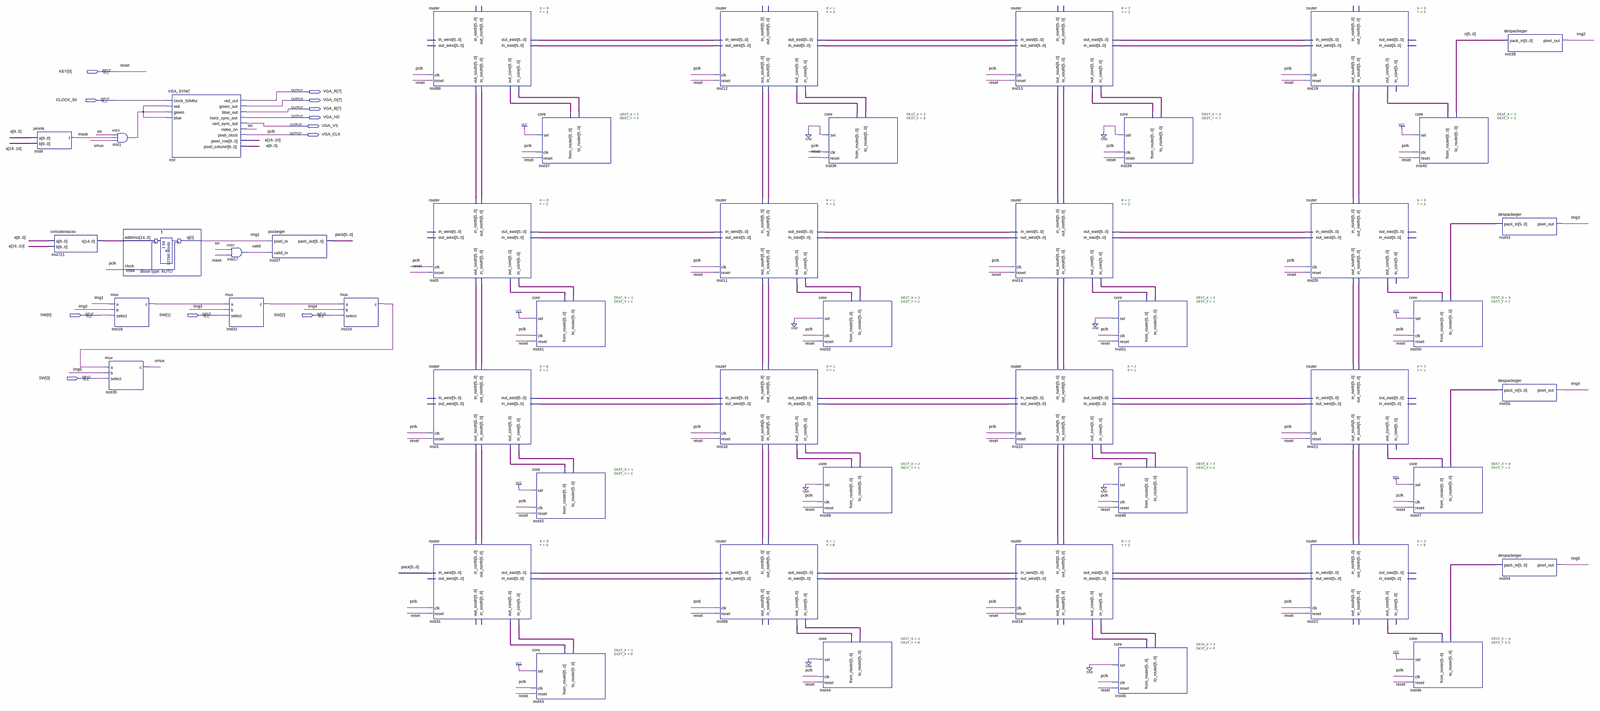
[diagram p0: schematic sheet, whole]
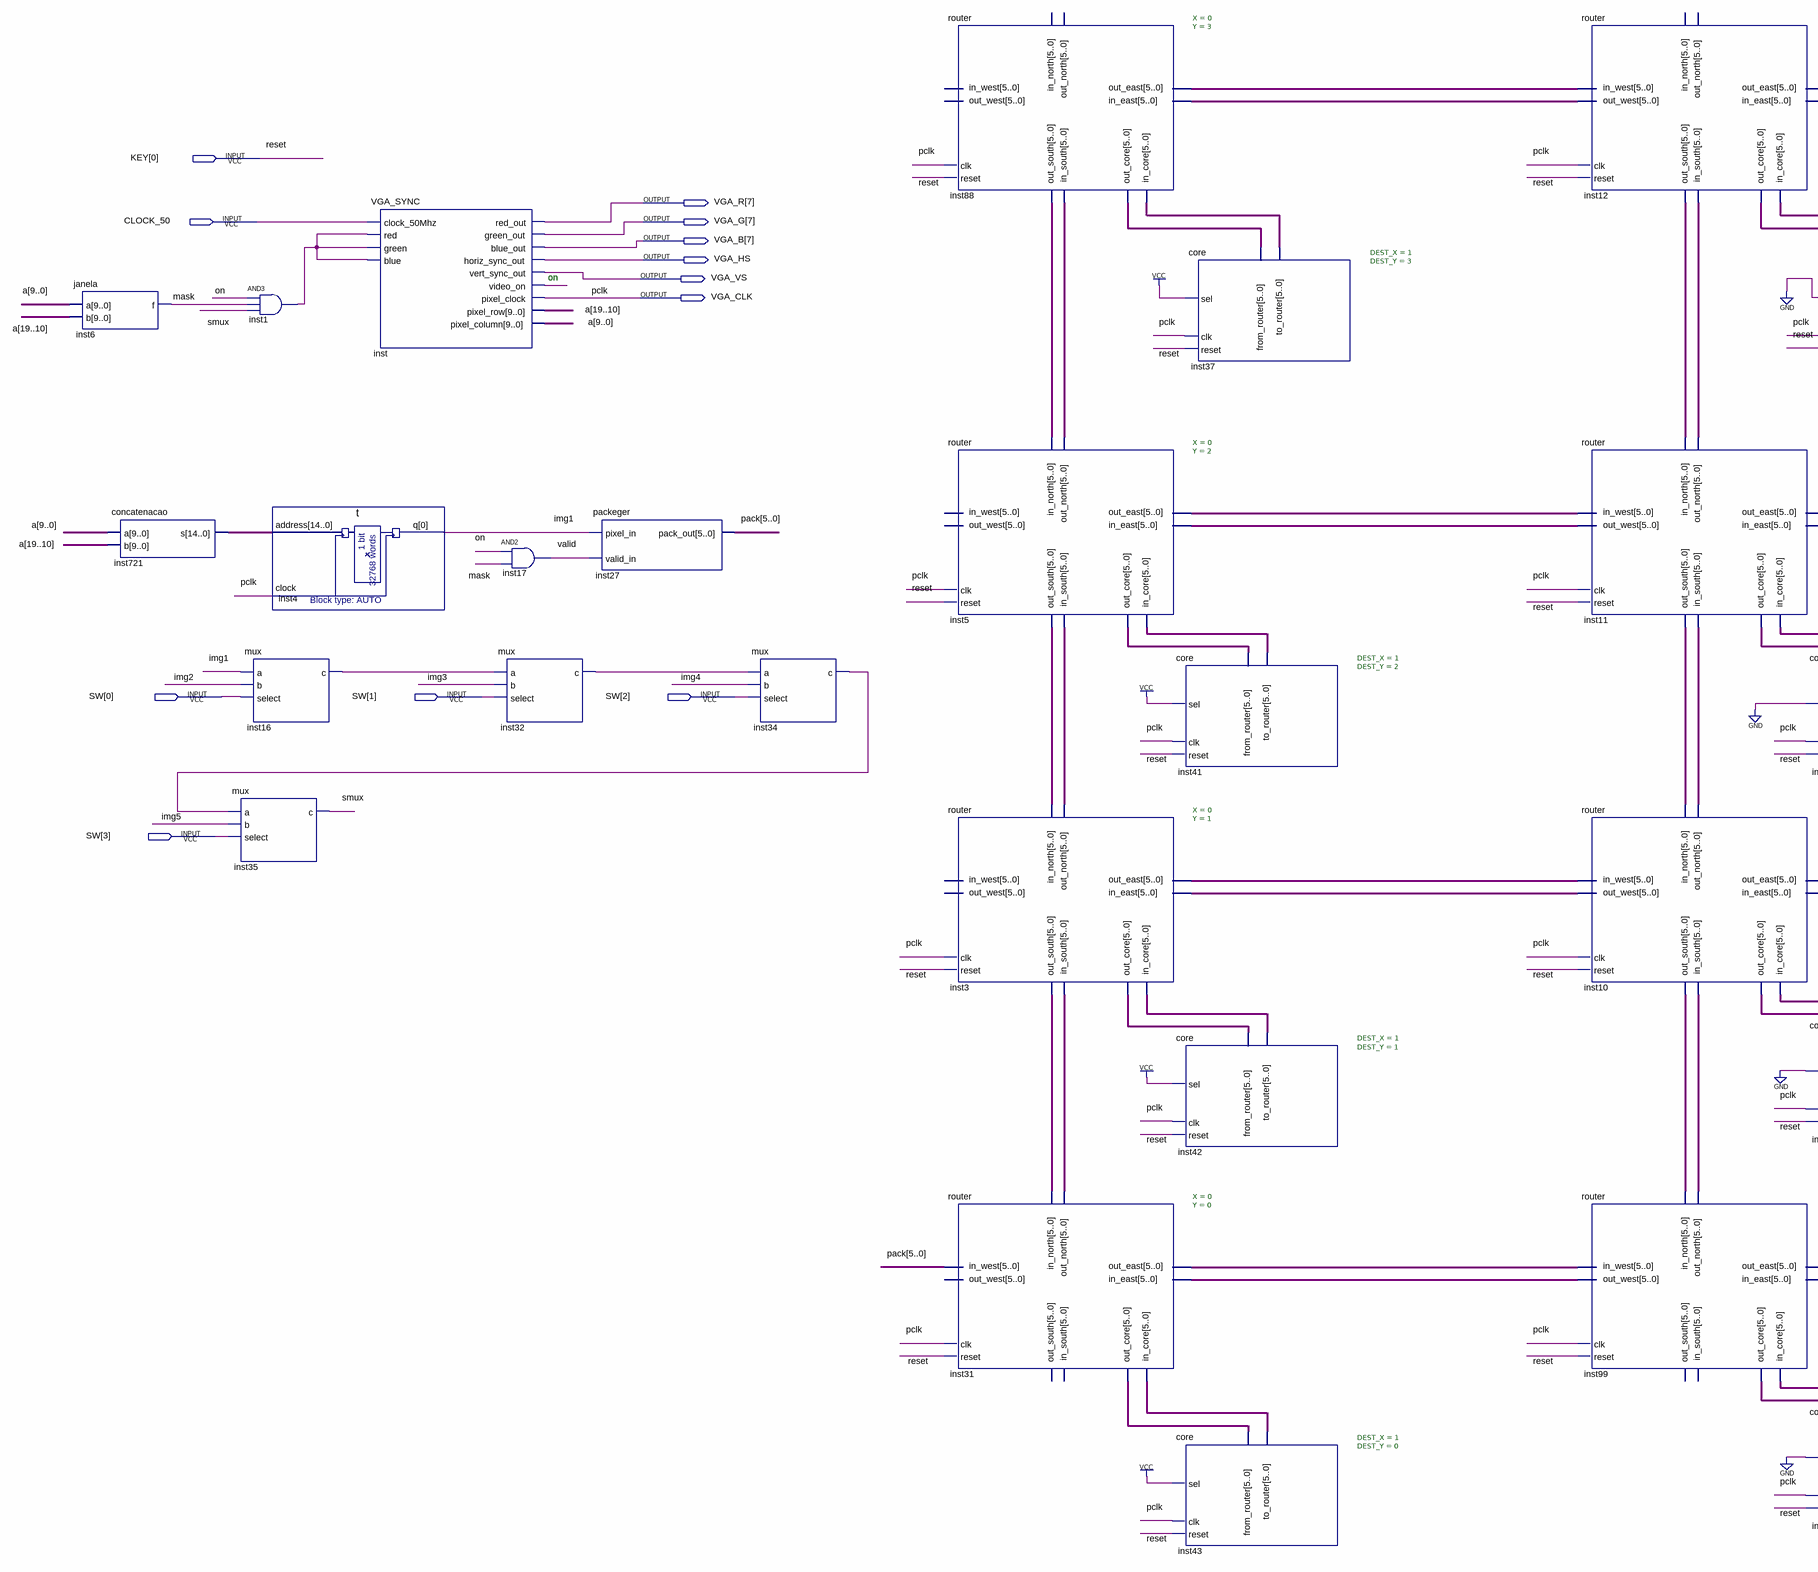
[diagram p1: schematic sheet, left part]
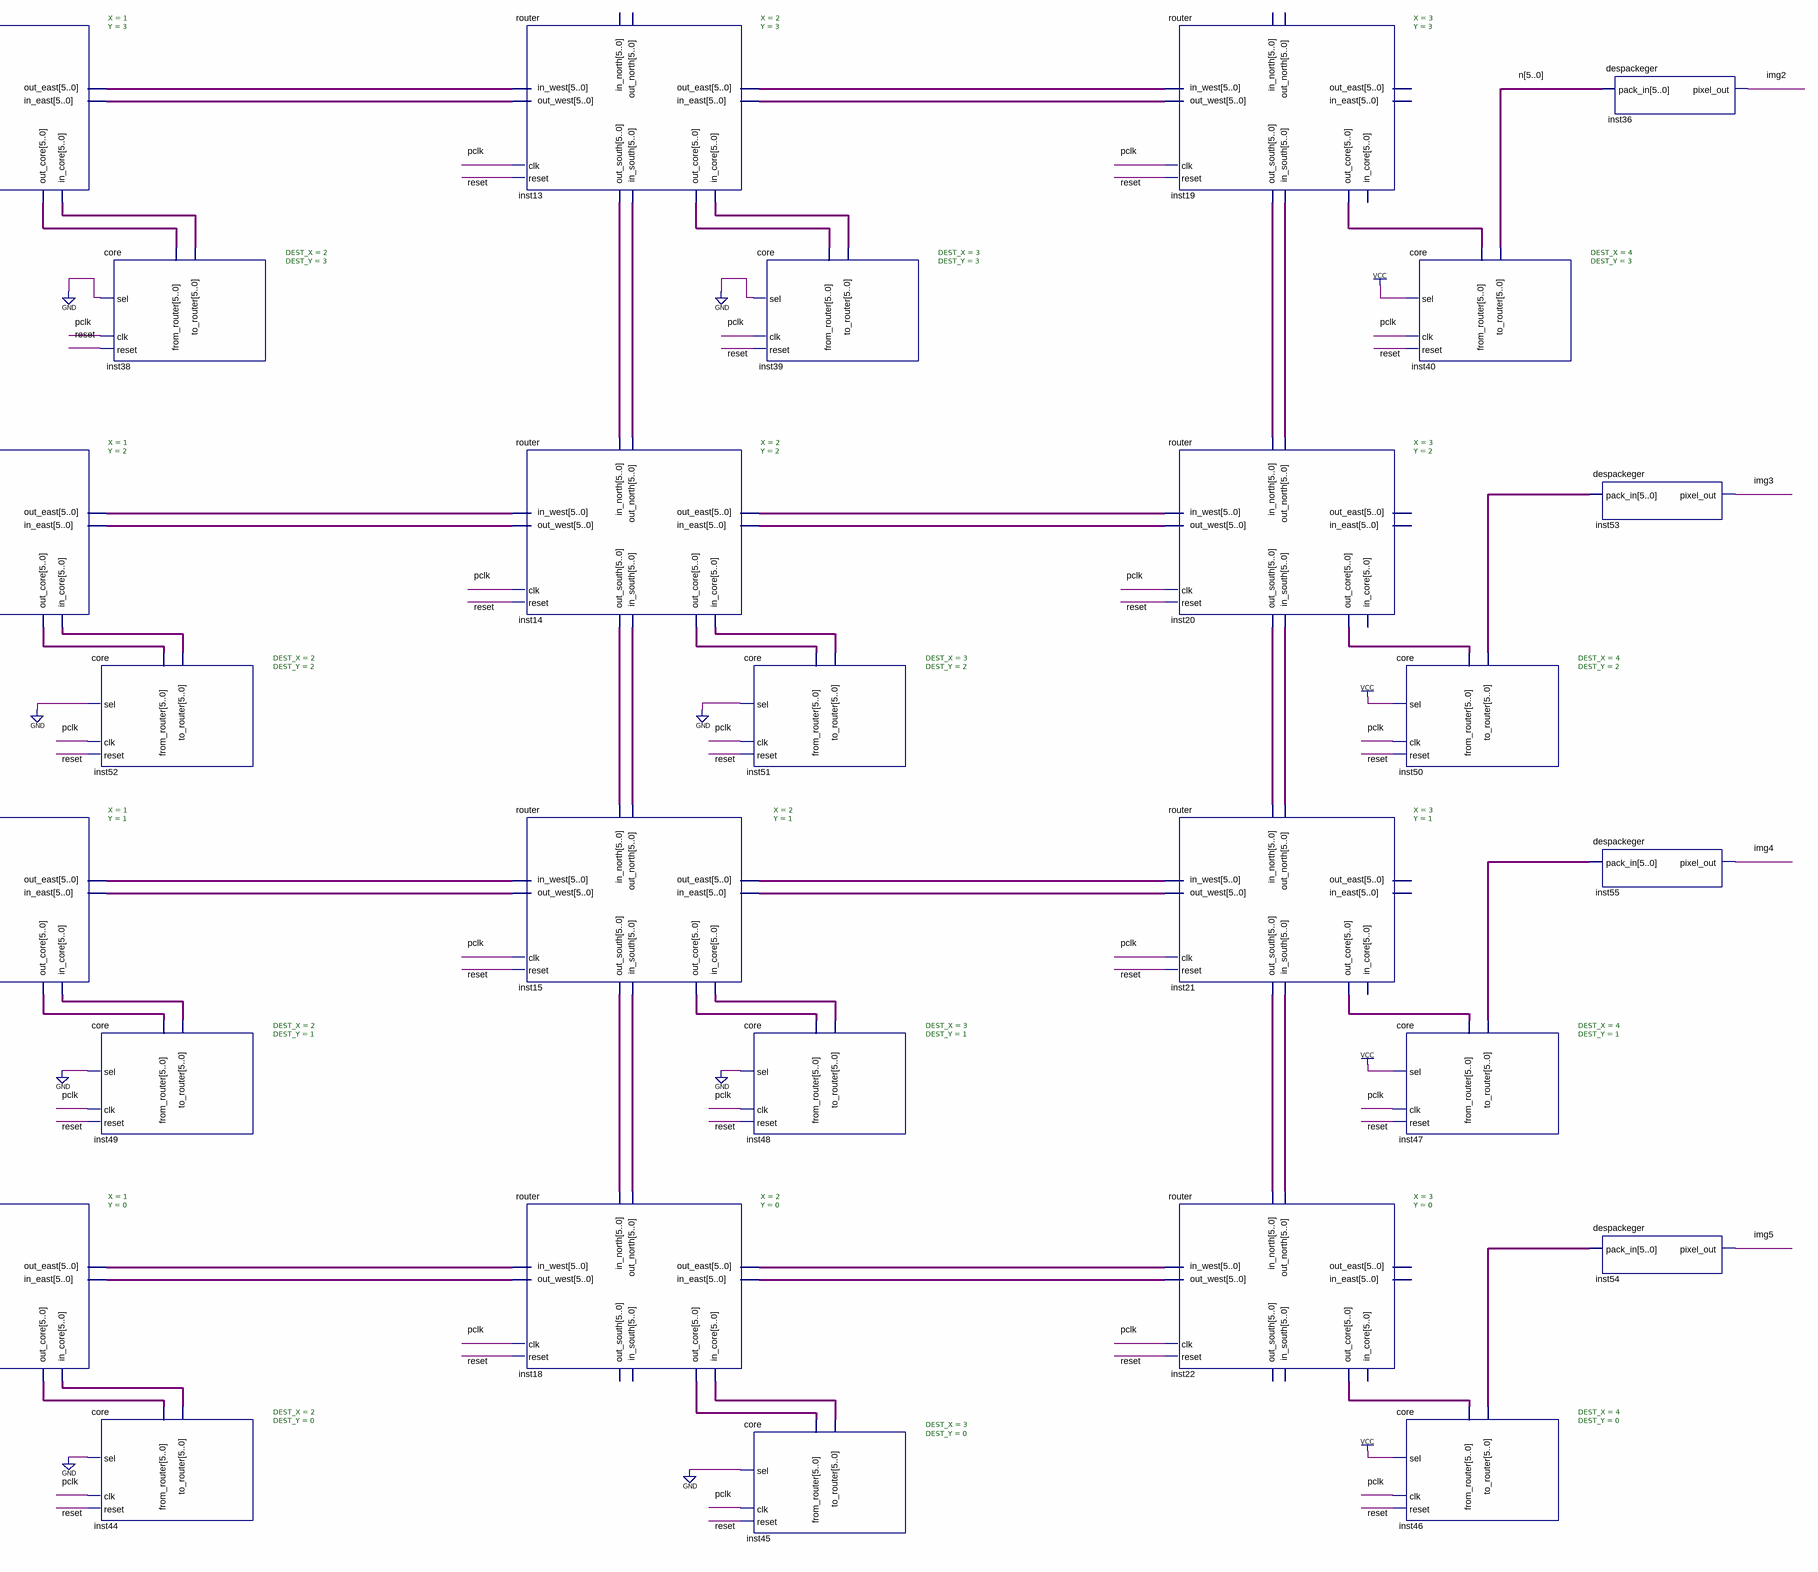
[diagram p2: schematic sheet, right part]
// Quartus schematic MeshPDI.bdf as structural Verilog: 47 symbols, 12 pins
module MeshPDI (
  input  [0:0] KEY,
  input  CLOCK_50,
  input  [3:0] SW,
  output [7:7] VGA_R,
  output [7:7] VGA_G,
  output [7:7] VGA_B,
  output VGA_HS,
  output VGA_VS,
  output VGA_CLK
);

  wire img1, img2, img3, img4, img5, inst1_out, inst16_c, inst32_c, inst34_c, mask, on, smux, valid;
  wire [5:0] inst3_out_core, inst3_out_east, inst3_out_north, inst3_out_south, inst5_out_core,
       inst5_out_east, inst5_out_north, inst5_out_south, inst10_out_core, inst10_out_east, inst10_out_north,
       inst10_out_south, inst10_out_west, inst11_out_core, inst11_out_east, inst11_out_north,
       inst11_out_south, inst11_out_west, inst12_out_core, inst12_out_east, inst12_out_south,
       inst12_out_west, inst13_out_core, inst13_out_east, inst13_out_south, inst13_out_west, inst14_out_core,
       inst14_out_east, inst14_out_north, inst14_out_south, inst14_out_west, inst15_out_core,
       inst15_out_east, inst15_out_north, inst15_out_south, inst15_out_west, inst18_out_core,
       inst18_out_east, inst18_out_north, inst18_out_west, inst19_out_core, inst19_out_south,
       inst19_out_west, inst20_out_core, inst20_out_north, inst20_out_south, inst20_out_west,
       inst21_out_core, inst21_out_north, inst21_out_south, inst21_out_west, inst22_out_core,
       inst22_out_north, inst22_out_west, inst31_out_core, inst31_out_east, inst31_out_north,
       inst37_to_router, inst38_to_router, inst39_to_router, inst41_to_router, inst42_to_router,
       inst43_to_router, inst44_to_router, inst45_to_router, inst46_to_router, inst47_to_router,
       inst48_to_router, inst49_to_router, inst50_to_router, inst51_to_router, inst52_to_router,
       inst88_out_core, inst88_out_east, inst88_out_south, inst99_out_core, inst99_out_east,
       inst99_out_north, inst99_out_west, n, pack;
  wire [14:0] inst721_s;
  wire [19:0] a;

  janela inst6 (.a(a[9:0]), .b(a[19:10]), .f(mask));
  concatenacao inst721 (.a(a[9:0]), .b(a[19:10]), .s(inst721_s));
  and inst1 (inst1_out, on, mask, smux);
  mux inst16 (.a(img1), .b(img2), .select(SW[0]), .c(inst16_c));
  mux inst35 (.a(inst34_c), .b(img5), .select(SW[3]), .c(smux));
  t inst4 (.address(inst721_s), .clock(VGA_CLK), .q(img1));
  VGA_SYNC inst (
    .clock_50Mhz(CLOCK_50), .red(inst1_out), .green(inst1_out), .blue(inst1_out), .red_out(VGA_R[7]),
    .green_out(VGA_G[7]), .blue_out(VGA_B[7]), .horiz_sync_out(VGA_HS), .vert_sync_out(VGA_VS),
    .video_on(on), .pixel_clock(VGA_CLK), .pixel_row(a[19:10]), .pixel_column(a[9:0]));
  and inst17 (valid, on, mask);
  mux inst32 (.a(inst16_c), .b(img3), .select(SW[1]), .c(inst32_c));
  packeger inst27 (.pixel_in(img1), .valid_in(valid), .pack_out(pack));
  mux inst34 (.a(inst32_c), .b(img4), .select(SW[2]), .c(inst34_c));
  router #(.X(0), .Y(3)) inst88 (
    .clk(VGA_CLK), .reset(KEY[0]), .in_east(inst12_out_west), .in_south(inst5_out_north),
    .in_core(inst37_to_router), .out_east(inst88_out_east), .out_south(inst88_out_south),
    .out_core(inst88_out_core));  // open: in_west, in_north, out_west, out_north
  router #(.X(0), .Y(2)) inst5 (
    .clk(VGA_CLK), .reset(KEY[0]), .in_east(inst11_out_west), .in_north(inst88_out_south),
    .in_south(inst3_out_north), .in_core(inst41_to_router), .out_east(inst5_out_east),
    .out_north(inst5_out_north), .out_south(inst5_out_south), .out_core(inst5_out_core));  // open: in_west, out_west
  router #(.X(0), .Y(1)) inst3 (
    .clk(VGA_CLK), .reset(KEY[0]), .in_east(inst10_out_west), .in_north(inst5_out_south),
    .in_south(inst31_out_north), .in_core(inst42_to_router), .out_east(inst3_out_east),
    .out_north(inst3_out_north), .out_south(inst3_out_south), .out_core(inst3_out_core));  // open: in_west, out_west
  router #(.X(0), .Y(0)) inst31 (
    .clk(VGA_CLK), .reset(KEY[0]), .in_west(pack), .in_east(inst99_out_west), .in_north(inst3_out_south),
    .in_core(inst43_to_router), .out_east(inst31_out_east), .out_north(inst31_out_north),
    .out_core(inst31_out_core));  // open: in_south, out_west, out_south
  core #(.DEST_X(1), .DEST_Y(3)) inst37 (
    .clk(VGA_CLK), .reset(KEY[0]), .sel(1'b1), .from_router(inst88_out_core), .to_router(inst37_to_router));
  core #(.DEST_X(1), .DEST_Y(2)) inst41 (
    .clk(VGA_CLK), .reset(KEY[0]), .sel(1'b1), .from_router(inst5_out_core), .to_router(inst41_to_router));
  core #(.DEST_X(1), .DEST_Y(1)) inst42 (
    .clk(VGA_CLK), .reset(KEY[0]), .sel(1'b1), .from_router(inst3_out_core), .to_router(inst42_to_router));
  core #(.DEST_X(1), .DEST_Y(0)) inst43 (
    .clk(VGA_CLK), .reset(KEY[0]), .sel(1'b1), .from_router(inst31_out_core), .to_router(inst43_to_router));
  router #(.X(1), .Y(3)) inst12 (
    .clk(VGA_CLK), .reset(KEY[0]), .in_west(inst88_out_east), .in_east(inst13_out_west),
    .in_south(inst11_out_north), .in_core(inst38_to_router), .out_west(inst12_out_west),
    .out_east(inst12_out_east), .out_south(inst12_out_south), .out_core(inst12_out_core));  // open: in_north, out_north
  router #(.X(1), .Y(2)) inst11 (
    .clk(VGA_CLK), .reset(KEY[0]), .in_west(inst5_out_east), .in_east(inst14_out_west),
    .in_north(inst12_out_south), .in_south(inst10_out_north), .in_core(inst52_to_router),
    .out_west(inst11_out_west), .out_east(inst11_out_east), .out_north(inst11_out_north),
    .out_south(inst11_out_south), .out_core(inst11_out_core));
  router #(.X(1), .Y(1)) inst10 (
    .clk(VGA_CLK), .reset(KEY[0]), .in_west(inst3_out_east), .in_east(inst15_out_west),
    .in_north(inst11_out_south), .in_south(inst99_out_north), .in_core(inst49_to_router),
    .out_west(inst10_out_west), .out_east(inst10_out_east), .out_north(inst10_out_north),
    .out_south(inst10_out_south), .out_core(inst10_out_core));
  router #(.X(1), .Y(0)) inst99 (
    .clk(VGA_CLK), .reset(KEY[0]), .in_west(inst31_out_east), .in_east(inst18_out_west),
    .in_north(inst10_out_south), .in_core(inst44_to_router), .out_west(inst99_out_west),
    .out_east(inst99_out_east), .out_north(inst99_out_north), .out_core(inst99_out_core));  // open: in_south, out_south
  core #(.DEST_X(2), .DEST_Y(3)) inst38 (
    .clk(VGA_CLK), .reset(KEY[0]), .sel(1'b0), .from_router(inst12_out_core), .to_router(inst38_to_router));
  core #(.DEST_X(2), .DEST_Y(2)) inst52 (
    .clk(VGA_CLK), .reset(KEY[0]), .sel(1'b0), .from_router(inst11_out_core), .to_router(inst52_to_router));
  core #(.DEST_X(2), .DEST_Y(1)) inst49 (
    .clk(VGA_CLK), .reset(KEY[0]), .sel(1'b0), .from_router(inst10_out_core), .to_router(inst49_to_router));
  core #(.DEST_X(2), .DEST_Y(0)) inst44 (
    .clk(VGA_CLK), .reset(KEY[0]), .sel(1'b0), .from_router(inst99_out_core), .to_router(inst44_to_router));
  router #(.X(2), .Y(3)) inst13 (
    .clk(VGA_CLK), .reset(KEY[0]), .in_west(inst12_out_east), .in_east(inst19_out_west),
    .in_south(inst14_out_north), .in_core(inst39_to_router), .out_west(inst13_out_west),
    .out_east(inst13_out_east), .out_south(inst13_out_south), .out_core(inst13_out_core));  // open: in_north, out_north
  router #(.X(2), .Y(2)) inst14 (
    .clk(VGA_CLK), .reset(KEY[0]), .in_west(inst11_out_east), .in_east(inst20_out_west),
    .in_north(inst13_out_south), .in_south(inst15_out_north), .in_core(inst51_to_router),
    .out_west(inst14_out_west), .out_east(inst14_out_east), .out_north(inst14_out_north),
    .out_south(inst14_out_south), .out_core(inst14_out_core));
  router #(.X(2), .Y(1)) inst15 (
    .clk(VGA_CLK), .reset(KEY[0]), .in_west(inst10_out_east), .in_east(inst21_out_west),
    .in_north(inst14_out_south), .in_south(inst18_out_north), .in_core(inst48_to_router),
    .out_west(inst15_out_west), .out_east(inst15_out_east), .out_north(inst15_out_north),
    .out_south(inst15_out_south), .out_core(inst15_out_core));
  router #(.X(2), .Y(0)) inst18 (
    .clk(VGA_CLK), .reset(KEY[0]), .in_west(inst99_out_east), .in_east(inst22_out_west),
    .in_north(inst15_out_south), .in_core(inst45_to_router), .out_west(inst18_out_west),
    .out_east(inst18_out_east), .out_north(inst18_out_north), .out_core(inst18_out_core));  // open: in_south, out_south
  core #(.DEST_X(3), .DEST_Y(3)) inst39 (
    .clk(VGA_CLK), .reset(KEY[0]), .sel(1'b0), .from_router(inst13_out_core), .to_router(inst39_to_router));
  core #(.DEST_X(3), .DEST_Y(2)) inst51 (
    .clk(VGA_CLK), .reset(KEY[0]), .sel(1'b0), .from_router(inst14_out_core), .to_router(inst51_to_router));
  core #(.DEST_X(3), .DEST_Y(1)) inst48 (
    .clk(VGA_CLK), .reset(KEY[0]), .sel(1'b0), .from_router(inst15_out_core), .to_router(inst48_to_router));
  core #(.DEST_X(3), .DEST_Y(0)) inst45 (
    .clk(VGA_CLK), .reset(KEY[0]), .sel(1'b0), .from_router(inst18_out_core), .to_router(inst45_to_router));
  router #(.X(3), .Y(3)) inst19 (
    .clk(VGA_CLK), .reset(KEY[0]), .in_west(inst13_out_east), .in_south(inst20_out_north),
    .out_west(inst19_out_west), .out_south(inst19_out_south), .out_core(inst19_out_core));  // open: in_east, in_north, in_core, out_east, out_north
  router #(.X(3), .Y(2)) inst20 (
    .clk(VGA_CLK), .reset(KEY[0]), .in_west(inst14_out_east), .in_north(inst19_out_south),
    .in_south(inst21_out_north), .out_west(inst20_out_west), .out_north(inst20_out_north),
    .out_south(inst20_out_south), .out_core(inst20_out_core));  // open: in_east, in_core, out_east
  router #(.X(3), .Y(1)) inst21 (
    .clk(VGA_CLK), .reset(KEY[0]), .in_west(inst15_out_east), .in_north(inst20_out_south),
    .in_south(inst22_out_north), .out_west(inst21_out_west), .out_north(inst21_out_north),
    .out_south(inst21_out_south), .out_core(inst21_out_core));  // open: in_east, in_core, out_east
  router #(.X(3), .Y(0)) inst22 (
    .clk(VGA_CLK), .reset(KEY[0]), .in_west(inst18_out_east), .in_north(inst21_out_south),
    .out_west(inst22_out_west), .out_north(inst22_out_north), .out_core(inst22_out_core));  // open: in_east, in_south, in_core, out_east, out_south
  core #(.DEST_X(4), .DEST_Y(3)) inst40 (
    .clk(VGA_CLK), .reset(KEY[0]), .sel(1'b1), .from_router(inst19_out_core), .to_router(n));
  core #(.DEST_X(4), .DEST_Y(2)) inst50 (
    .clk(VGA_CLK), .reset(KEY[0]), .sel(1'b1), .from_router(inst20_out_core), .to_router(inst50_to_router));
  core #(.DEST_X(4), .DEST_Y(1)) inst47 (
    .clk(VGA_CLK), .reset(KEY[0]), .sel(1'b1), .from_router(inst21_out_core), .to_router(inst47_to_router));
  core #(.DEST_X(4), .DEST_Y(0)) inst46 (
    .clk(VGA_CLK), .reset(KEY[0]), .sel(1'b1), .from_router(inst22_out_core), .to_router(inst46_to_router));
  despackeger inst36 (.pack_in(n), .pixel_out(img2));
  despackeger inst53 (.pack_in(inst50_to_router), .pixel_out(img3));
  despackeger inst55 (.pack_in(inst47_to_router), .pixel_out(img4));
  despackeger inst54 (.pack_in(inst46_to_router), .pixel_out(img5));

  // Other names for the same wires on the sheet: pclk = VGA_CLK; reset = KEY[0]

  // Notes on the sheet:
  //   on
endmodule
